# EAGLE design 521_servo_pwm_lora (EAGLE 9.6.2)
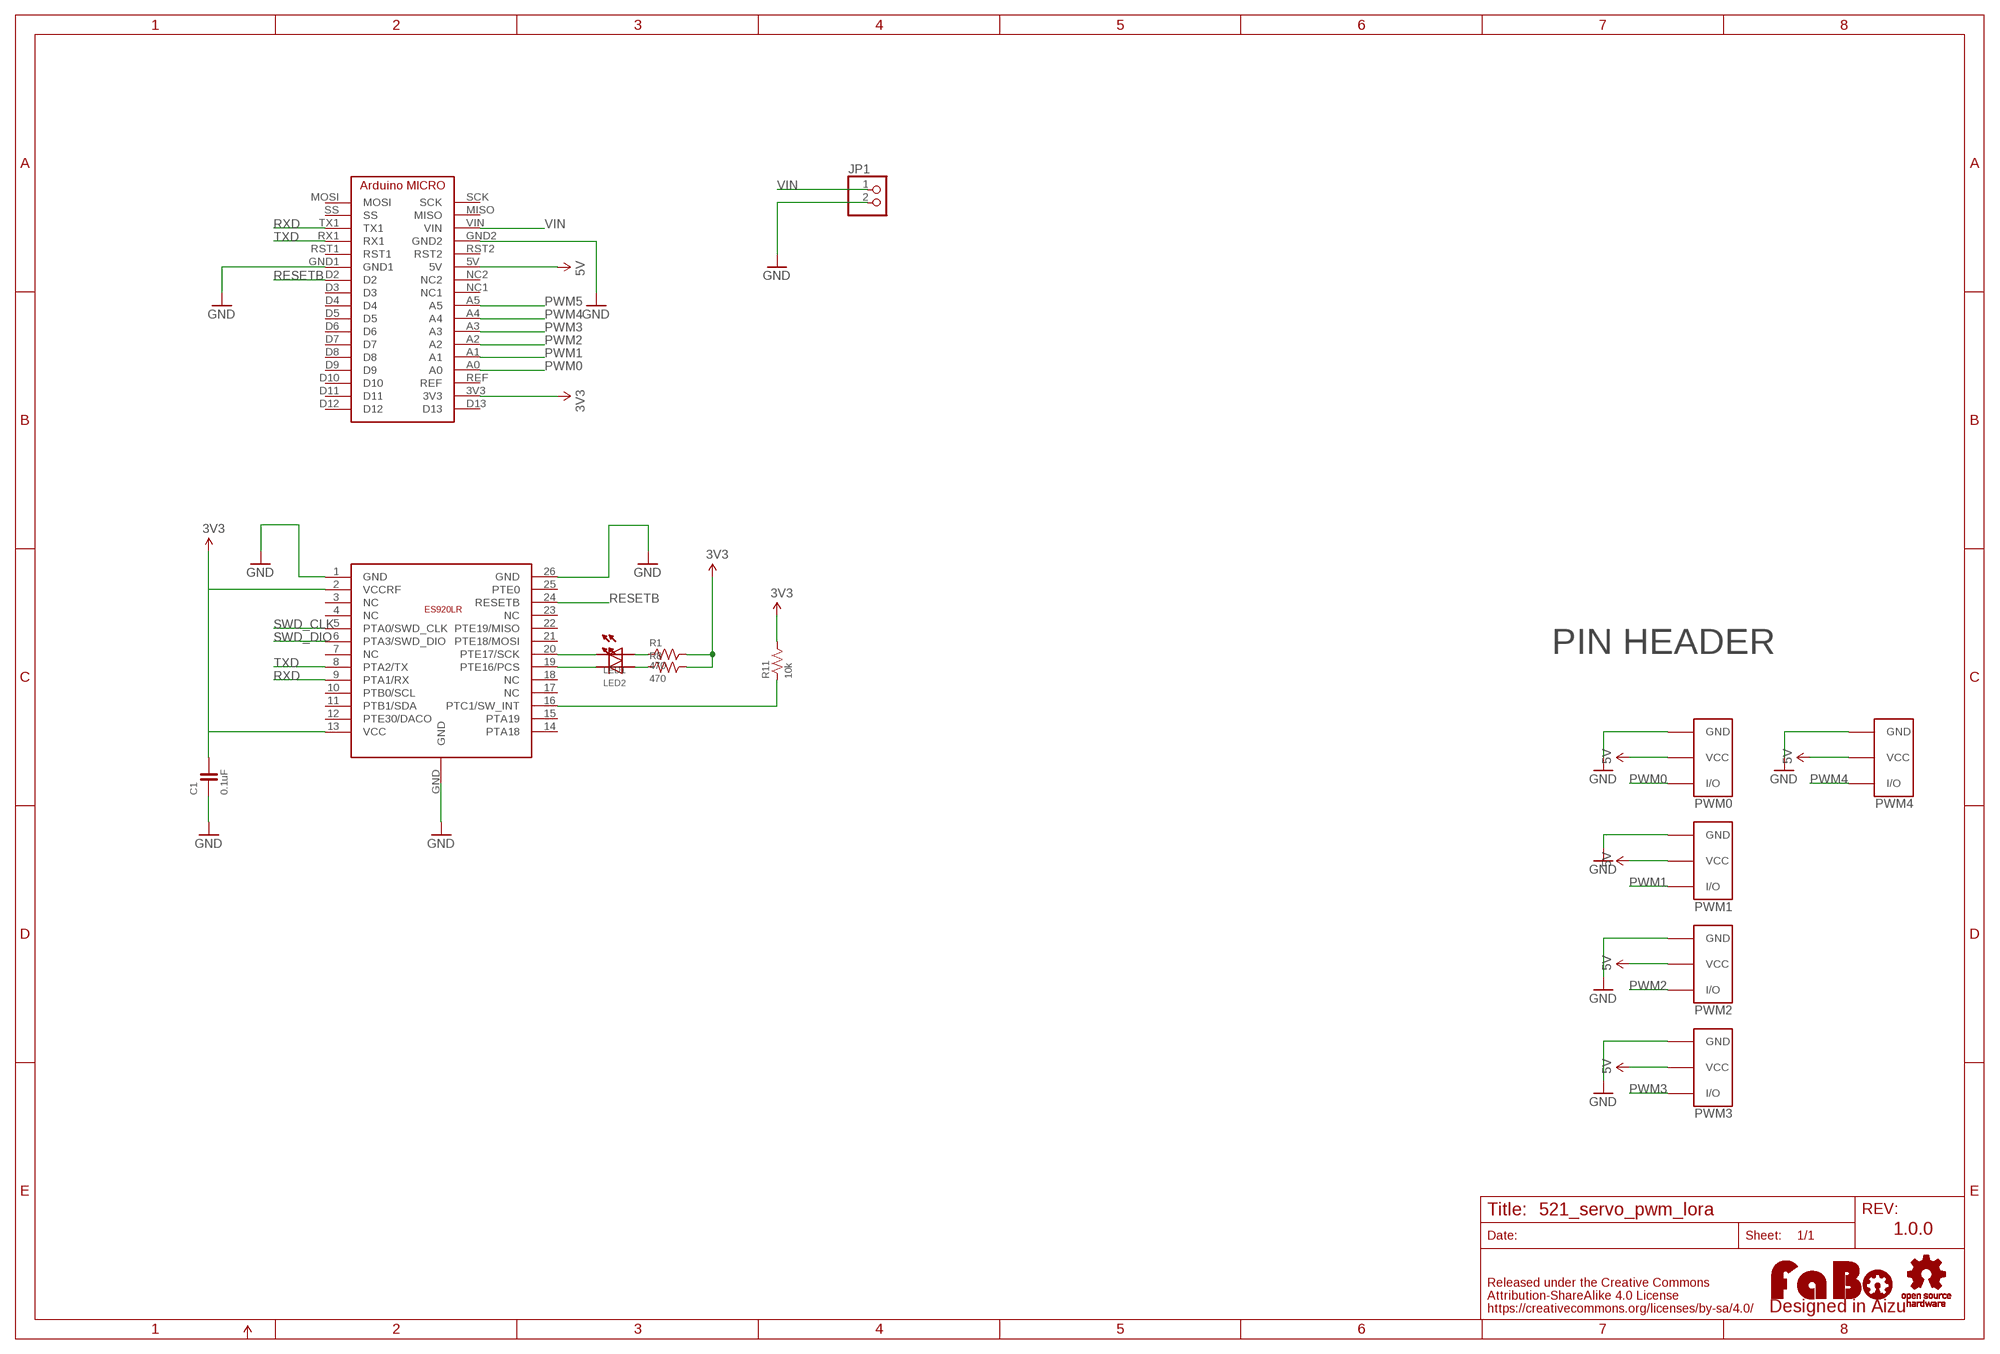
[diagram p0: schematic, sheet 1]

## Parts
C1  0.1uF  CAPACITOR-0603_NARROW  [0603-NARROW]
JP1  PINHD-1X2  [1X02]
LED1  LED-0603  [0603]
LED2  LED-0603  [0603]
LOGO1  LOGO_FABO-M_BOTTOM  [LOGO_FABO_M_BOTTOM]
PWM0  FABO_BRICK_3PIN-HEADER  [FABO_BRICK_3PIN_HEADER]
PWM1  FABO_BRICK_3PIN-HEADER  [FABO_BRICK_3PIN_HEADER]
PWM2  FABO_BRICK_3PIN-HEADER  [FABO_BRICK_3PIN_HEADER]
PWM3  FABO_BRICK_3PIN-HEADER  [FABO_BRICK_3PIN_HEADER]
PWM4  FABO_BRICK_3PIN-HEADER  [FABO_BRICK_3PIN_HEADER]
R1  470  RESISTOR-0603-NARROW  [0603-NARROW]
R8  470  RESISTOR-0603-NARROW  [0603-NARROW]
R11  10k  RESISTOR-0603-NARROW  [0603-NARROW]
U$2  ARDUINO_MICRO_LORA  [ARDUINO_MICRO_LORA]
U$3  LOGO_OSHW-M_BOTTOM  [LOGO_OSHW_M_BOTTOM]
U$4  ES920LR  [ES920LR]

## Nets
3V3: C1.2 R1.2 R8.2 R11.2 U$2.3V3 U$4.2(VCCRF) U$4.13(VCC)
5V: PWM0.VCC PWM1.VCC PWM2.VCC PWM3.VCC PWM4.VCC U$2.5V
GND: C1.1 JP1.2 PWM0.GND PWM1.GND PWM2.GND PWM3.GND PWM4.GND U$2.GND1 U$4.1(GND) U$4.26(GND) U$4.GND
N$1: U$2.GND2 ; supply symbol labelled GND
N$3: LED2.CATHODE U$4.19(PTE16/PCS)
N$4: LED1.CATHODE U$4.20(PTE17/SCK)
N$5: LED1.ANODE R1.1
N$6: LED2.ANODE R8.1
N$12: R11.1 U$4.16(PTC1/SW_INT)
PWM0: PWM0.I/O U$2.A0
PWM1: PWM1.I/O U$2.A1
PWM2: PWM2.I/O U$2.A2
PWM3: PWM3.I/O U$2.A3
PWM4: PWM4.I/O U$2.A4
PWM5: U$2.A5
RESETB: U$2.D2 U$4.24(RESETB)
RXD: U$2.TX1 U$4.9(PTA1/RX)
SWD_CLK: U$4.5(PTA0/SWD_CLK)
SWD_DIO: U$4.6(PTA3/SWD_DIO)
TXD: U$2.RX1 U$4.8(PTA2/TX)
VIN: JP1.1 U$2.VIN
Unconnected: U$2.D3 U$2.D4 U$2.D5 U$2.D6 U$2.D7 U$2.D8 U$2.D9 U$2.D10 U$2.D11 U$2.D12 U$2.D13 U$2.MISO U$2.MOSI U$2.NC1 U$2.NC2 U$2.REF U$2.RST1 U$2.RST2 U$2.SCK U$2.SS U$4.3(NC) U$4.4(NC) U$4.7(NC) U$4.10(PTB0/SCL) U$4.11(PTB1/SDA) U$4.12(PTE30/DACO) U$4.14(PTA18) U$4.15(PTA19) U$4.17(NC) U$4.18(NC) U$4.21(PTE18/MOSI) U$4.22(PTE19/MISO) U$4.23(NC) U$4.25(PTE0)

## Notes on the sheet
- PIN HEADER
- 1.0.0

## Library data of the parts
C1 = FaBo-Capacitor:CAPACITOR: CAPACITOR
JP1 = pinhead:PINHD-1X2: PIN HEADER
LED1 LED2 = FaBo-LED:LED
LOGO1 = component:LOGO_FABO
PWM0 PWM1-PWM4 = FaBo-Template:FABO_BRICK_3PIN: FaBo Brick 3pin
R1 R8 R11 = FaBo-Resistors:RESISTOR: RESISTOR
U$2 = FaBo-Boards:ARDUINO_MICRO
U$3 = component:LOGO_OSHW
U$4 = FaBo-LoRa:ES920LR

## Board
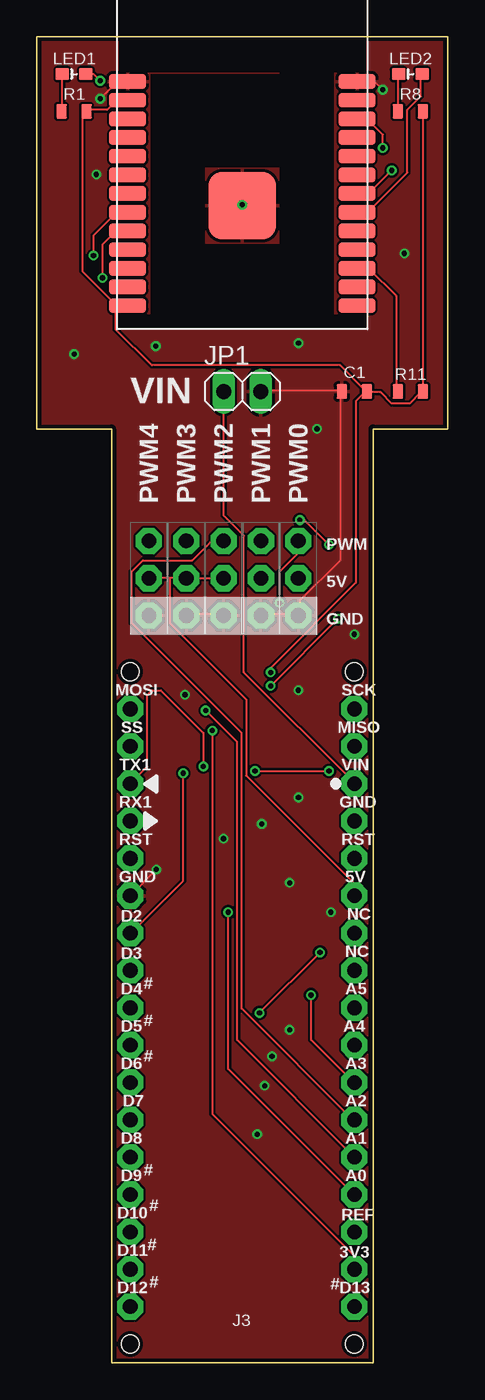
[diagram p1: board, top side]
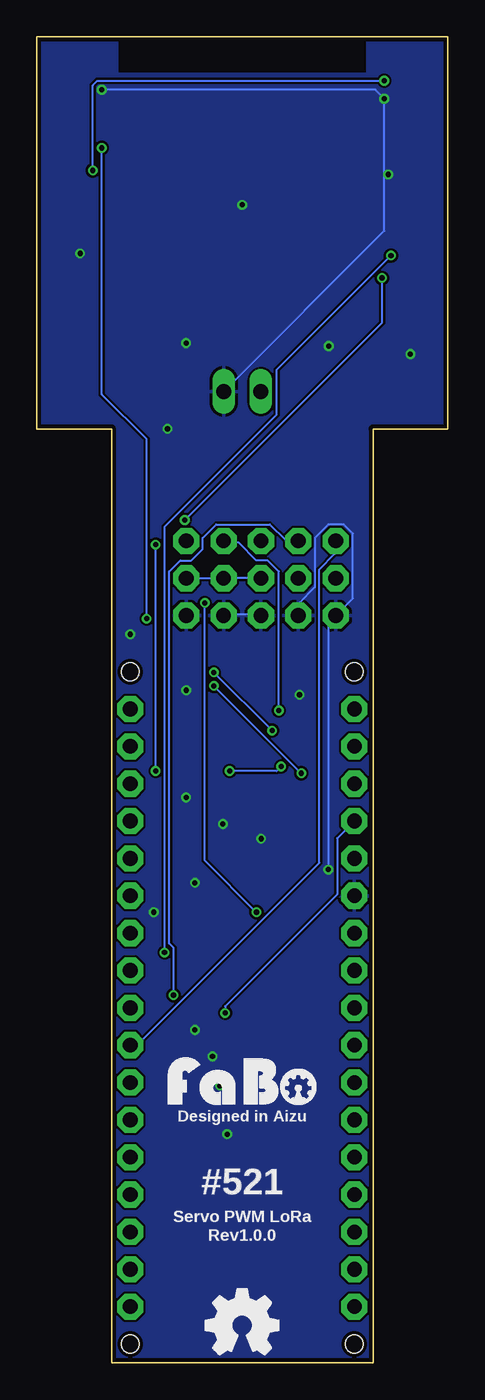
[diagram p2: board, bottom side, seen from below]

Size 27.94 x 90.17 mm. Coordinates in mm from the lower left corner, seen from the top.
Copper layers (1*16): Top 0.035mm / dielectric 1.6mm / Bottom 0.035mm
Design rules "PCBway": minimum track width 6mil, minimum drill 12mil, track to track 6mil, track to pad 6mil, pad to pad 6mil, via to via 6mil, smd to smd 6mil, copper to edge 10mil, drill to drill 10mil, minimum pad ring 10mil, minimum via ring 6mil, stop-mask expansion 2mil, vias tented up to drill 100mil, thermal gap 8mil

### Footprints (pad centres in the part's own frame; a part is rotated, then mirrored left to right if it is on the bottom)
0603-NARROW = smd 0.71 x 1: 1 -0.85,0; 2 0.85,0
1X02 = drill 1.016 long: 1 -1.27,0; 2 1.27,0
0603 = smd 0.9 x 0.8: ANODE -0.8,0; CATHODE 0.8,0
FABO_BRICK_3PIN_HEADER = drill 1 pad 1.778 octagon: GND -2.54,0; I/O 2.54,0; VCC 0,0
ARDUINO_MICRO_LORA = drill 1 pad 1.778 octagon: 3V3 6.35,-24.13; 5V 6.35,1.27; A0 6.35,-19.05; A1 6.35,-16.51; A2 6.35,-13.97; A3 6.35,-11.43; A4 6.35,-8.89; A5 6.35,-6.35; D2 -8.89,-1.27; D3 -8.89,-3.81; D4 -8.89,-6.35; D5 -8.89,-8.89; D6 -8.89,-11.43; D7 -8.89,-13.97; D8 -8.89,-16.51; D9 -8.89,-19.05; D10 -8.89,-21.59; D11 -8.89,-24.13; D12 -8.89,-26.67; D13 6.35,-26.67; GND1 -8.89,1.27; GND2 6.35,6.35; MISO 6.35,11.43; MOSI -8.89,13.97; NC1 6.35,-3.81; NC2 6.35,-1.27; REF 6.35,-21.59; RST1 -8.89,3.81; RST2 6.35,3.81; RX1 -8.89,6.35; SCK 6.35,13.97; SS -8.89,11.43; TX1 -8.89,8.89; VIN 6.35,8.89 | hole 1.2: -8.89,-29.216; 6.35,-29.216; -8.89,16.504; 6.35,16.504
ES920LR = smd 2.5 x 1: 1 -7.8,5.84; 2 -7.8,4.57; 3 -7.8,3.3; 4 -7.8,2.03; 5 -7.8,0.76; 6 -7.8,-0.51; 7 -7.8,-1.78; 8 -7.8,-3.05; 9 -7.8,-4.32; 10 -7.8,-5.59; 11 -7.8,-6.86; 12 -7.8,-8.13; 13 -7.8,-9.4; 14 7.8,-9.4; 15 7.8,-8.13; 16 7.8,-6.86; 17 7.8,-5.59; 18 7.8,-4.32; 19 7.8,-3.05; 20 7.8,-1.78; 21 7.8,-0.51; 22 7.8,0.76; 23 7.8,2.03; 24 7.8,3.3; 25 7.8,4.57; 26 7.8,5.84 | smd 4.6 x 4.6: GND 0,-2.6

### Placement (x,y rotation side)
C1  21.59,66.05 0 top
JP1  13.97,66.05 0 top
LED1  2.54,87.64 0 top
LED2  25.4,87.64 0 top
LOGO1  13.97,17.15 0 top
PWM0  17.78,53.35 90 top
PWM1  15.24,53.35 90 top
PWM2  12.7,53.35 90 top
PWM3  10.16,53.35 90 top
PWM4  7.62,53.35 90 top
R1  2.54,85.1 0 top
R8  25.4,85.1 0 top
R11  25.4,66.05 0 top
U$2  15.24,30.49 0 top
U$3  13.97,2.55 0 top
U$4  13.97,81.29 0 top

### Tracks (layer width: path | path; a pad name or v marks a point on that pad's centre or on a via)
3V3  (via drill 0.35)
  Top 0.152: U$4.2 6.15,85.81 5.38,85.81 4.78,85.2 3.4,85.2 R1.2 3.25,85.05 3.1,84.89 3.1,74.23 5.38,71.94 | 5.38,71.94 6.15,71.94 U$4.13 5.38,71.94 | C1.2 22.45,66 23.37,66 24.13,65.23 25.35,65.23 26.11,66 R11.2 26.26,66.15 26.26,85.05 R8.2 | v11.94,42.98 11.94,16.92 21.54,7.32 21.54,6.41 U$2.3V3 | v15.9,46.95 15.9,47.25 21.69,53.04 21.69,65.39 22.3,66 C1.2 | 5.38,71.94 5.38,70.26 7.82,67.82 20.62,67.82 22.3,66.15 C1.2
  Bottom 0.152: v15.9,46.95 v11.94,42.98
5V
  Top 0.152: 9.04,53.35 PWM3.VCC PWM2.VCC | 9.04,53.35 PWM4.VCC | 9.04,53.35 9.04,50.3 14.22,45.12 14.22,39.94 21.54,32.62 21.54,31.86 U$2.5V
  Bottom 0.152: PWM0.VCC PWM1.VCC PWM2.VCC
GND  (via drill 0.35)
  Top 0.152: PWM3.GND 10.26,50.91 12.7,50.91 PWM2.GND | PWM1.GND 15.29,50.91 17.73,50.91 PWM0.GND 17.88,50.91 17.88,51.82 20.62,54.57 20.62,66 C1.1 20.62,66.15 15.29,66.15 JP1.2 | v8.13,33.53 U$2.GND1 | v4.32,85.96 5.38,87.03 6.15,87.03 U$4.1 | v23.52,86.57 23.06,87.03 21.84,87.03 U$4.26
  Bottom 0.152: PWM2.GND 12.7,50.91 15.14,50.91 PWM1.GND | v8.13,33.53 8.13,50.3 PWM4.GND 6.45,51.97 6.45,56.39 7.06,57 8.13,57 9.04,56.09 9.04,52.74 10.11,51.67 10.11,50.91 PWM3.GND | JP1.2 4.32,76.97 v4.32,85.96 4.93,86.57 v23.52,86.57
  other vias: 13.97,78.75 2.54,68.59 19.05,63.51 21.59,49.54 17.78,45.73 24.99,75.44 17.79,69.34 8.09,69.14 15.29,36.64 17.19,32.64 19.99,30.64 17.19,22.64 15.99,20.84 15.49,18.84 14.99,15.54 12.69,35.64 17.79,38.44 4.05,80.81 10.08,45.43
  pour Bottom: 0,90.18 0,0.01 27.94,0.01 27.94,90.18
  pour Top: 0,0.01 27.94,0.01 27.94,90.18 0,90.18 0,1.28
N$3
  Top 0.152: LED2.CATHODE 26.11,87.64 26.11,86.11 25.2,85.2 25.2,80.93 22.61,78.34 21.84,78.34 U$4.19
N$4  (via drill 0.35)
  Top 0.152: LED1.CATHODE 3.86,87.64 v4.32,87.18 | v24.13,81.08 22.61,79.56 21.84,79.56 U$4.20
  Bottom 0.152: v4.32,87.18 23.83,87.18 24.13,86.87 v24.13,81.08
N$5
  Top 0.152: LED1.ANODE 1.73,87.64 1.73,85.2 R1.1
N$6
  Top 0.152: LED2.ANODE 24.59,87.64 24.59,85.2 R8.1
N$12
  Top 0.152: R11.1 24.44,66.15 24.44,72.55 22.61,74.38 21.84,74.38 U$4.16
PWM0  (via drill 0.35)
  Top 0.152: v16.51,51.67 16.51,53.8 17.73,55.02 17.73,55.78 PWM0.I/O | v13,30.64 13,19.97 21.54,11.44 U$2.A0
  Bottom 0.152: v16.51,51.67 16.51,34.14 v13,30.64
PWM1  (via drill 0.35)
  Top 0.152: v11.48,44.35 13.61,42.22 13.61,21.95 U$2.A1
  Bottom 0.152: v11.48,44.35 11.48,53.8 12.24,54.57 13,54.57 14.22,55.78 15.14,55.78 PWM1.I/O
PWM2
  Top 0.152: PWM2.I/O 12.7,55.78 11.79,55.78 10.57,54.57 7.21,54.57 6.45,53.8 6.45,50.3 13.92,42.83 13.92,24.09 21.54,16.47 U$2.A2
PWM3  (via drill 0.35)
  Top 0.152: v18.64,25 18.64,21.95 21.54,19.06 U$2.A3
  Bottom 0.152: v18.64,25 18.64,28.2 18.95,28.51 18.95,53.8 18.19,54.57 17.42,54.57 16.66,55.33 16.66,56.09 15.75,57 12.09,57 11.02,55.94 10.26,55.94 PWM3.I/O
PWM4
  Bottom 0.152: PWM4.I/O 7.67,55.78 7.67,55.02 8.74,53.96 8.74,33.99 21.08,21.65 21.54,21.65 U$2.A4
RESETB  (via drill 0.35)
  Top 0.152: v23.52,82.61 23.52,83.52 22.61,84.44 21.84,84.44 U$4.24 | v15.9,46.03 v20.47,50.6 | v9.96,40.09 9.96,32.77 6.45,29.27 U$2.D2
  Bottom 0.152: v23.52,82.61 23.52,65.84 20.47,62.8 v20.47,50.6 | v9.96,40.09 v15.9,46.03
RXD  (via drill 0.35)
  Top 0.152: v4.47,73.77 4.47,76.05 5.23,76.82 6.15,76.82 U$4.9 | v17.88,57.31 18.19,57.31 v19.86,55.63 | v14.83,40.24 v19.86,40.24 | v11.33,40.54 11.33,42.83 8.43,45.73 7.82,45.73 7.52,45.42 7.52,40.54 U$2.TX1
  Bottom 0.152: v4.47,73.77 4.47,70.72 v17.88,57.31 | v19.86,40.24 v19.86,55.63 | v14.83,40.24 11.63,40.24 v11.33,40.54
TXD  (via drill 0.35)
  Top 0.152: v3.86,75.29 3.86,76.66 5.38,78.19 6.15,78.19 U$4.8 | v15.14,23.78 v19.25,27.9
  Bottom 0.152: v3.86,75.29 11.63,67.52 11.63,64.47 19.25,56.85 v19.25,27.9 | v15.14,23.78 15.14,24.24 7.52,31.86 7.52,35.67 U$2.RX1
VIN
  Top 0.152: JP1.1 12.7,57.61 14.07,56.24 14.07,46.95 21.54,39.48 U$2.VIN

### Text on the board
tPlace: VIN | PWM | 5V | GND
bPlace: Designed in Aizu | #521 | Servo PWM LoRa | Rev1.0.0